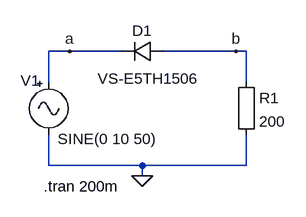
[diagram p0: schematic Diode-Rectifier-4.asc]
Diode-Rectifier-4.asc, the LTspice schematic file:
Version 4
SHEET 1 880 680
WIRE -224 144 -256 144
WIRE -144 144 -224 144
WIRE 32 144 -80 144
WIRE 48 144 32 144
WIRE -256 192 -256 144
WIRE 48 192 48 144
WIRE -256 320 -256 272
WIRE -112 320 -256 320
WIRE 48 320 48 272
WIRE 48 320 -112 320
WIRE -112 336 -112 320
FLAG -112 336 0
FLAG -224 144 a
FLAG 32 144 b
SYMBOL diode -80 128 R90
WINDOW 0 0 32 VBottom 2
WINDOW 3 42 23 VTop 2
SYMATTR InstName D1
SYMATTR Value VS-E5TH1506
SYMBOL Misc\\EuropeanResistor 32 176 R0
SYMATTR InstName R1
SYMATTR Value 200
SYMBOL Misc\\signal -256 176 R0
WINDOW 123 0 0 Left 2
WINDOW 39 0 0 Left 2
WINDOW 0 -43 13 Left 2
WINDOW 3 14 103 Left 2
SYMATTR InstName V1
SYMATTR Value SINE(0 10 50)
TEXT -264 352 Left 2 !.tran 200m

The netlist it stands for:
* Diode-Rectifier-4.asc
D1 b a VS-E5TH1506
R1 b 0 200
V1 a 0 SINE(0 10 50)
.model D D
.lib standard.dio
.tran 200m
.backanno
.end